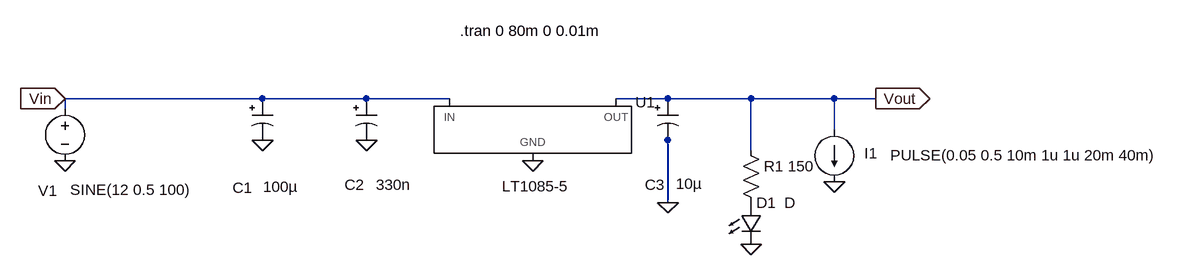
[diagram p0: schematic schema_ltspice_reponse_charge.asc]
schema_ltspice_reponse_charge.asc, the LTspice schematic file:
Version 4
SHEET 1 1228 680
WIRE -176 144 -480 144
WIRE -16 144 -176 144
WIRE 112 144 -16 144
WIRE 448 144 368 144
WIRE 576 144 448 144
WIRE 704 144 576 144
WIRE 768 144 704 144
WIRE -480 160 -480 144
WIRE 704 192 704 144
WIRE 448 208 448 192
WIRE 576 224 576 144
WIRE 448 304 448 208
FLAG -480 240 0
FLAG 768 144 Vout
IOPIN 768 144 Out
FLAG -480 144 Vin
IOPIN -480 144 In
FLAG -176 208 0
FLAG 240 240 0
FLAG 448 304 0
FLAG -16 208 0
FLAG 704 272 0
FLAG 576 368 0
SYMBOL PowerProducts\\LT1085-5 240 144 R0
WINDOW 3 -47 135 Left 2
SYMATTR InstName U1
SYMBOL polcap -192 144 R0
WINDOW 3 17 136 Left 2
WINDOW 0 -30 137 Left 2
SYMATTR Value 100µ
SYMATTR InstName C1
SYMATTR Description Capacitor
SYMATTR Type cap
SYMATTR SpiceLine V=6.3 Irms=0 Rser=0.9 Lser=0 mfg="AVX" pn="TAJD107M006" type="Tantalum"
SYMBOL polcap -32 144 R0
WINDOW 3 31 133 Left 2
WINDOW 0 -18 133 Left 2
SYMATTR Value 330n
SYMATTR InstName C2
SYMATTR Description Capacitor
SYMATTR Type cap
SYMATTR SpiceLine V=6.3 Irms=0 Rser=0.9 Lser=0
SYMBOL polcap 432 144 R0
WINDOW 3 28 131 Left 2
WINDOW 0 -19 133 Left 2
SYMATTR Value 10µ
SYMATTR InstName C3
SYMATTR Description Capacitor
SYMATTR Type cap
SYMATTR SpiceLine V=6.3 Irms=0 Rser=4 Lser=0
SYMBOL LED 560 304 R0
WINDOW 3 67 0 Left 2
SYMATTR InstName D1
SYMBOL voltage -480 144 R0
WINDOW 3 8 140 Left 2
WINDOW 123 0 0 Left 0
WINDOW 39 0 0 Left 0
WINDOW 0 -41 142 Left 2
SYMATTR Value SINE(12 0.5 100)
SYMATTR InstName V1
SYMBOL current 704 192 R0
WINDOW 123 0 0 Left 0
WINDOW 39 0 0 Left 0
WINDOW 0 46 36 Left 2
WINDOW 3 86 39 Left 2
SYMATTR InstName I1
SYMATTR Value PULSE(0.05 0.5 10m 1u 1u 20m 40m)
SYMBOL res 560 208 R0
WINDOW 3 73 40 Left 2
SYMATTR InstName R1
SYMATTR Value 150
TEXT 128 40 Left 2 !.tran 0 80m 0 0.01m

The netlist it stands for:
* schema_ltspice_reponse_charge.asc
XU1 0 Vout Vin LT1085-5  ; pins GND OUT IN
C1 Vin 0 100µ V=6.3 Irms=0 Rser=0.9 Lser=0 mfg="AVX" pn="TAJD107M006" type="Tantalum"
C2 Vin 0 330n V=6.3 Irms=0 Rser=0.9 Lser=0
C3 Vout 0 10µ V=6.3 Irms=0 Rser=4 Lser=0
D1 P001 0 D
V1 Vin 0 SINE(12 0.5 100)
I1 Vout 0 PULSE(0.05 0.5 10m 1u 1u 20m 40m)
R1 Vout P001 150
.model D D
.lib standard.dio
.tran 0 80m 0 0.01m
.backanno
.end